# Altium schematic sheet UpstreamPort.SchDoc
size Letter; CompanyName: Ploopy Co; Organization: Ploopy Co; Address1: 137-1140 Burnhamthorpe Road W; Address2: Mississauga; Address3: Ontario; Address4: Canada L5C 0A3; DocumentNumber: 3; Revision: R1.001; SheetNumber: 3; SheetTotal: 7
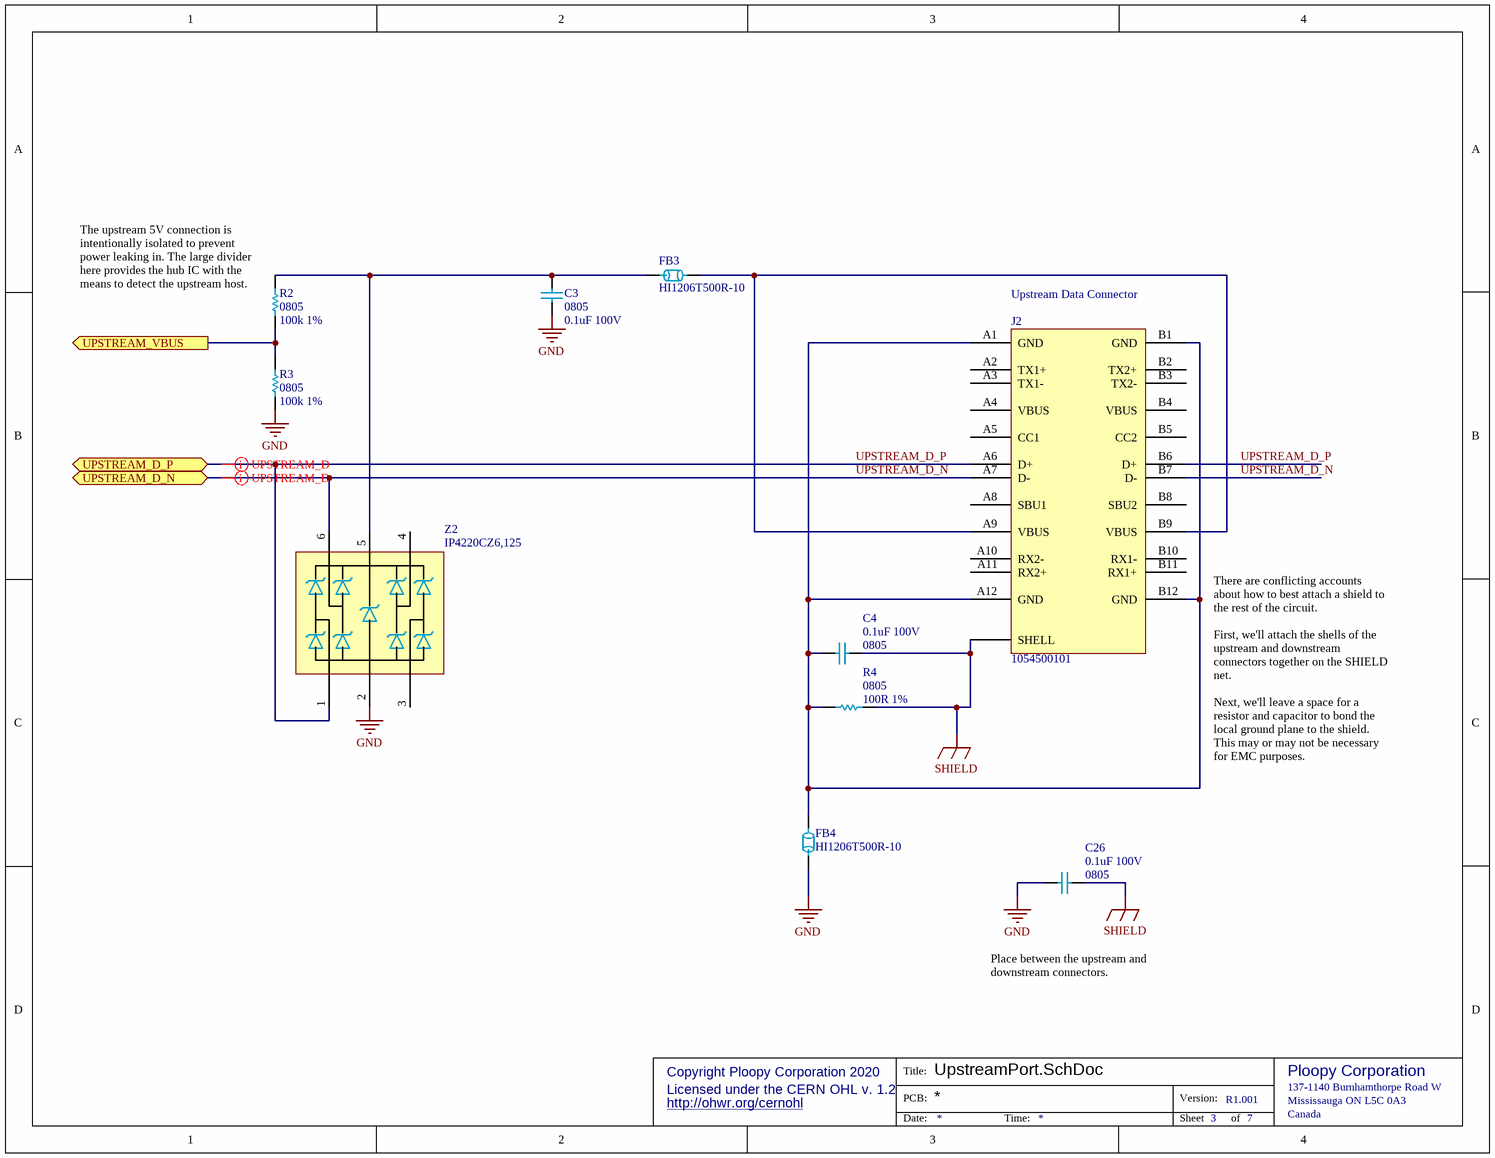
[diagram p0: UpstreamPort.SchDoc]

## Parts
C3  0805  value 0.1uF 100V  [0805]
C4  0805  value 0.1uF 100V  [0805]
C26  0805  value 0.1uF 100V  [0805]
FB3  HI1206T500R-10  [1206]
FB4  HI1206T500R-10  [1206]
J2  1054500101  [1054500101]
R2  0805  value 100k 1%  [0805]
R3  0805  value 100k 1%  [0805]
R4  0805  value 100R 1%  [0805]
Z2  IP4220CZ6,125  [PESD3V3S4UD - SOT95P275X110-6N]

## Ports
UPSTREAM_D_N (bidir), UPSTREAM_D_P (bidir), UPSTREAM_VBUS (out)

## Nets
GND: C3.1 C26.1 FB4.1 R3.1 Z2.2
SHIELD: C4.2 C26.2 J2.SHELL R4.2
UPSTREAM_D_N: J2.A7(D-) J2.B7(D-) Z2.6 ; port UPSTREAM_D_N
UPSTREAM_D_P: J2.A6(D+) J2.B6(D+) Z2.1 ; port UPSTREAM_D_P
UPSTREAM_VBUS: R2.1 R3.2 ; port UPSTREAM_VBUS
NetC3_2: C3.2 FB3.1 R2.2 Z2.5
NetC4_1: C4.1 FB4.2 J2.A1(GND) J2.A12(GND) J2.B1(GND) J2.B12(GND) R4.1
NetFB3_2: FB3.2 J2.A9(VBUS) J2.B9(VBUS)

Not connected (* = marked no-connect by the designer): J2 A2(TX1+) A3(TX1-) A4(VBUS) A5(CC1) A8(SBU1) A10(RX2-) A11(RX2+) B2(TX2+) B3(TX2-) B4(VBUS) B5(CC2) B8(SBU2) B10(RX1-) B11(RX1+); Z2 3 4

## Layout directives
differential pair: UPSTREAM_D_N, UPSTREAM_D_P

## Notes on the sheet
- (near J2) Upstream Data Connector
- (near R2) The upstream 5V connection is intentionally isolated to prevent power leaking in. The large divider here provides the hub IC with the means to detect the upstream host.
- There are conflicting accounts about how to best attach a shield to the rest of the circuit.
  First, we'll attach the shells of the upstream and downstream connectors together on the SHIELD net.
  Next, we'll leave a space for a resistor and capacitor to bond the local ground plane to the shield. This may or may not be necessary for EMC purposes.
- Place between the upstream and downstream connectors.
- Copyright Ploopy Corporation 2020
- Licensed under the CERN OHL v. 1.2
- http://ohwr.org/cernohl
- Title:
- PCB:
- Version:
- Ploopy Corporation
- Mississauga ON L5C 0A3
- 137-1140 Burnhamthorpe Road W
- Date:
- Time:
- Sheet
- of
- Canada

## Library data of the parts
C3 C4 C26 = Cap 0.1uF 100V: 0805, X5R or better; Supplier 1: Digi-Key; Supplier Part Number 1: 1276-6840-2-ND
FB3 FB4 = HI1206T500R-10: 50 Ohms @ 100MHz 1 Power, Signal Line Ferrite Bead 1206 (3216 Metric) 6A 10mOhm; Value: Ferrite Bead 50R 6A; Supplier 1: Digi-Key; Supplier 2: Mouser; Supplier Part Number 1: 240-2412-1-ND; Supplier Part Number 2: 875-HI1206T500R-10
J2 = 1054500101: USB - C (Type - C) USB 3.1 (USB 3.1 Gen 2, Superspeed+) Receptacle Connector 24 Position Surface Mount, Right Angle; Through Hole; Supplier 1: Digi-Key; Supplier 2: Arrow; Supplier Part Number 2: 105450-0101; Supplier Part Number 1: WM12856CT-ND
R2 R3 = Res 100k 1% 0805: Chip resistor; Supplier 1: Digi-Key; Supplier 2: Digi-Key; Supplier Part Number 1: RMCF0805FT100KTR-ND; Supplier Part Number 2: RMCF0805FT100KCT-ND
R4 = Res 100R 1% 0805: Chip resistor; Supplier 1: Digi-Key; Supplier 2: Digi-Key; Supplier Part Number 1: RMCF0805FT100RCT-ND; Supplier Part Number 2: RMCF0805FT100RTR-ND
Z2 = IP4220CZ6,125: TVS DIODE 5.5V 6TSOP (Low capacitance, USB); Supplier 1: Digi-Key; Supplier 2: Mouser; Supplier 3: Arrow; Supplier Part Number 1: 1727-3578-1-ND; Supplier Part Number 2: 771-IP4220CZ6-T/R; Supplier Part Number 3: IP4220CZ6,125